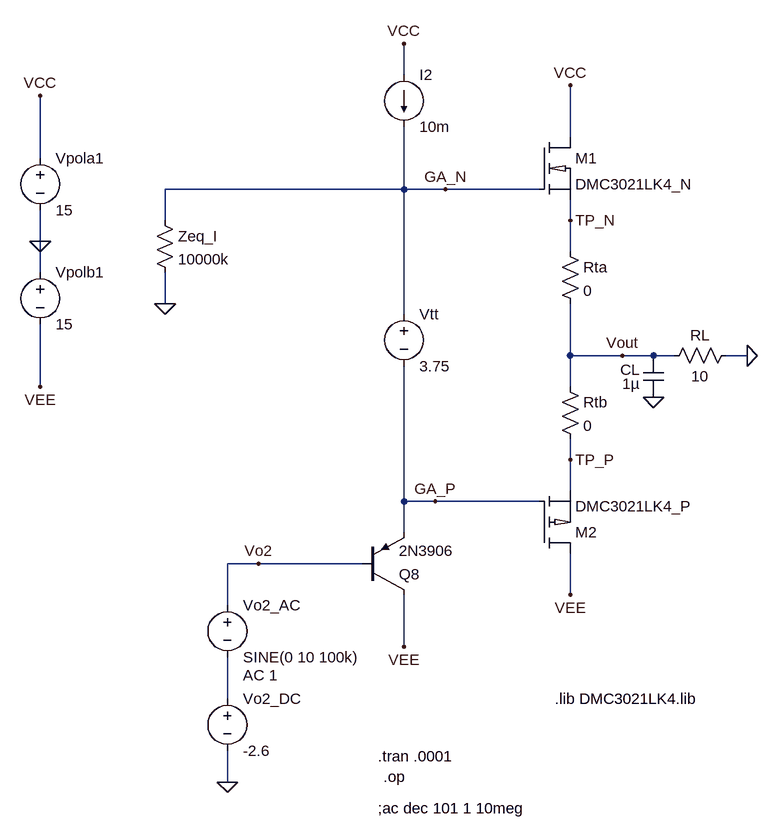
[diagram p0: schematic LT_ETAGE_3_SIMPLIFIE.asc]
LT_ETAGE_3_SIMPLIFIE.asc, the LTspice schematic file:
Version 4
SHEET 1 2404 1432
WIRE 1232 -352 1232 -400
WIRE 1488 -256 1488 -336
WIRE 672 -224 672 -320
WIRE 1232 -176 1232 -272
WIRE 1232 -176 864 -176
WIRE 1296 -176 1232 -176
WIRE 1440 -176 1296 -176
WIRE 864 -128 864 -176
WIRE 1488 -128 1488 -160
WIRE 672 -96 672 -144
WIRE 1488 -80 1488 -128
WIRE 672 -48 672 -96
WIRE 864 0 864 -48
WIRE 1232 16 1232 -176
WIRE 1488 80 1488 0
WIRE 1568 80 1488 80
WIRE 1616 80 1568 80
WIRE 1648 80 1616 80
WIRE 1760 80 1728 80
WIRE 672 128 672 32
WIRE 1488 128 1488 80
WIRE 1488 240 1488 208
WIRE 1488 288 1488 240
WIRE 1232 304 1232 96
WIRE 1280 304 1232 304
WIRE 1440 304 1280 304
WIRE 1232 352 1232 304
WIRE 1008 400 960 400
WIRE 1168 400 1008 400
WIRE 1488 448 1488 384
WIRE 960 464 960 400
WIRE 1232 528 1232 448
WIRE 960 608 960 544
WIRE 960 736 960 688
FLAG 1760 80 0
FLAG 1488 -336 VCC
FLAG 1488 448 VEE
FLAG 1232 -400 VCC
FLAG 1232 528 VEE
FLAG 1296 -176 GA_N
FLAG 1280 304 GA_P
FLAG 1568 80 Vout
FLAG 1488 -128 TP_N
FLAG 1488 240 TP_P
FLAG 1616 144 0
FLAG 1008 400 Vo2
FLAG 960 736 0
FLAG 672 -320 VCC
FLAG 672 128 VEE
FLAG 672 -96 0
FLAG 864 0 0
SYMBOL res 1472 -96 R0
SYMATTR InstName Rta
SYMATTR Value 0
SYMBOL res 1472 112 R0
SYMATTR InstName Rtb
SYMATTR Value 0
SYMBOL res 1744 64 R90
WINDOW 0 0 56 VBottom 2
WINDOW 3 32 56 VTop 2
SYMATTR InstName RL
SYMATTR Value 10
SYMBOL pnp 1168 448 M180
SYMATTR InstName Q8
SYMATTR Value 2N3906
SYMBOL cap 1600 80 R0
WINDOW 0 -35 22 Left 2
WINDOW 3 -32 43 Left 2
SYMATTR InstName CL
SYMATTR Value 1µ
SYMBOL nmos_3021 1440 -256 R0
SYMATTR InstName M1
SYMBOL pmos_3021 1440 384 M180
SYMATTR InstName M2
SYMBOL voltage 1232 0 R0
WINDOW 123 0 0 Left 0
WINDOW 39 0 0 Left 0
SYMATTR InstName Vtt
SYMATTR Value 3.75
SYMBOL current 1232 -352 R0
WINDOW 123 0 0 Left 0
WINDOW 39 0 0 Left 0
SYMATTR InstName I2
SYMATTR Value 10m
SYMBOL voltage 960 448 R0
WINDOW 123 24 124 Left 2
WINDOW 39 0 0 Left 0
SYMATTR InstName Vo2_AC
SYMATTR Value SINE(0 10 100k)
SYMATTR Value2 AC 1
SYMBOL voltage 960 592 R0
WINDOW 123 0 0 Left 0
WINDOW 39 0 0 Left 0
SYMATTR InstName Vo2_DC
SYMATTR Value -2.6
SYMBOL voltage 672 -240 R0
WINDOW 123 0 0 Left 0
WINDOW 39 0 0 Left 0
SYMATTR InstName Vpola1
SYMATTR Value 15
SYMBOL voltage 672 -64 R0
WINDOW 123 0 0 Left 0
WINDOW 39 0 0 Left 0
SYMATTR InstName Vpolb1
SYMATTR Value 15
SYMBOL res 848 -144 R0
SYMATTR InstName Zeq_I
SYMATTR Value 10000k
TEXT 1200 728 Left 2 !.op
TEXT 1192 776 Left 2 !;ac dec 101 1 10meg
TEXT 1192 696 Left 2 !.tran .0001
TEXT 1464 608 Left 2 !.lib DMC3021LK4.lib

The netlist it stands for:
* LT_ETAGE_3_SIMPLIFIE.asc
Rta TP_N Vout 0
Rtb Vout TP_P 0
RL 0 Vout 10
Q8 VEE Vo2 GA_P 0 2N3906
CL Vout 0 1µ
XM1 VCC GA_N TP_N DMC3021LK4_N  ; pins D G S
XM2 VEE GA_P TP_P DMC3021LK4_P  ; pins D G S
Vtt GA_N GA_P 3.75
I2 VCC GA_N 10m
Vo2_AC Vo2 N001 SINE(0 10 100k) AC 1
Vo2_DC N001 0 -2.6
Vpola1 VCC 0 15
Vpolb1 0 VEE 15
R§Zeq_I GA_N 0 10000k
.model NPN NPN
.model PNP PNP
.lib standard.bjt
.op
;ac dec 101 1 10meg
.tran .0001
.lib DMC3021LK4.lib
.lib DMC3021LK4.lib
.backanno
.end